# EAGLE design AM-Crystal-RX-LM324 (EAGLE 7.6.0)
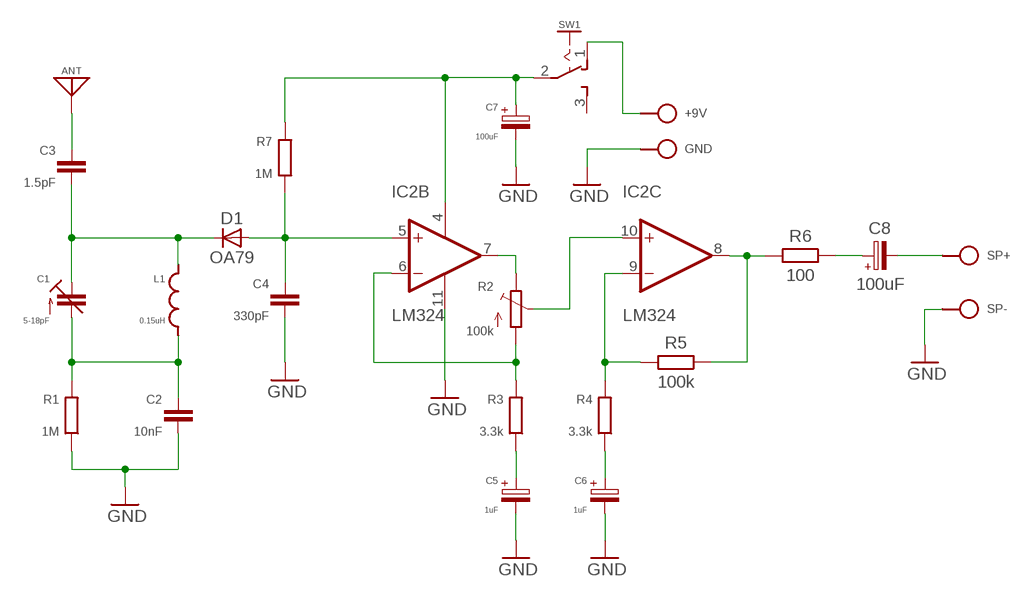
[diagram p0: schematic, sheet 1]

## Parts
+9V  BAT+  SPAD  [SPAD]
ANT  ANT  [SPAD]
C1  5-18pF  C-TR-PH201272222-808-2PIN  [TRIM-2222-808]
C2  10nF  C050-025X075/V  [C050-025X075/V]
C3  1.5pF  C050-020X036  [C050-020X036]
C4  330pF  C050-024X044/V  [C050-024X044/V]
C5  1uF  CPOLE2,5-4/V  [E2.5-4/V]
C6  1uF  CPOLE2,5-3  [E2,5-3]
C7  100uF  CPOLE5-5/V  [E5-5/V]
C8  100uF  CPOLE2,5-5/V  [E2,5-5/V]
D1  OA79  OA7918/V  [OA79-18/V]
GND  BAT-  SPAD  [SPAD]
IC2  LM324  LM324N  [DIL14]
L1  0.15uH  L-SHORT04-5/5  [L-04-5/5]
R1  1M  R0202/7-V  [0202/7-V]
R2  100k  TRIM  [B64Y]
R3  3.3k  R0202/7  [0202/7]
R4  3.3k  R0202/7-V  [0202/7-V]
R5  100k  R0202/7-V  [0202/7-V]
R6  100  R0202/7-V  [0202/7-V]
R7  1M  R0202/7-V  [0202/7-V]
SP+  SPKR+  SPAD  [SPAD]
SP-  SPKR-  SPAD  [SPAD]
SW1  SL-SW-1P-2T-H  [SLSW-1P2T-H]

## Nets
A: IC2.7(B:OUT) R2.E
E: IC2.6(B:-IN) R2.A R3.2
GND: C2.2 C4.2 C5.- C6.- C7.- GND.1 IC2.11(P:V-) R1.1 SP-.1
N$1: C4.1 D1.A IC2.5(B:+IN) R7.1
N$2: C7.+ IC2.4(P:V+) R7.2 SW1.2(P)
N$3: C1.1(A) C2.1 L1.1 R1.2
N$5: C1.2(E) C3.2 D1.C L1.2
N$6: ANT.1 C3.1
N$9: IC2.8(C:OUT) R5.1 R6.2
N$10: IC2.9(C:-IN) R4.2 R5.2
N$11: C5.+ R3.1
N$12: C6.+ R4.1
N$13: C8.+ R6.1
N$14: C8.- SP+.1
N$15: +9V.1 SW1.1(O)
S: IC2.10(C:+IN) R2.S
Unconnected: IC2.1(A:OUT) IC2.2(A:-IN) IC2.3(A:+IN) IC2.12(D:+IN) IC2.13(D:-IN) IC2.14(D:OUT) SW1.3(S)

## Library data of the parts
+9V GND SP+ SP- = pad:SPAD
ANT = pad:ANT
C1 = cap-trim:C-TR-PH20127
C2-C4 = c:C: CAPACITOR, European symbol
C5-C8 = c:CPOL: POLARIZED CAPACITOR, European symbol
D1 = d:OA79
IC2 = ic:LM324: OP AMP
L1 = r:L-SHORT
R1 R3-R7 = r:R: RESISTOR, European symbol
R2 = r:TRIM: POTENTIOMETER
SW1 = sw:SL-SW-1P-2T

## Board
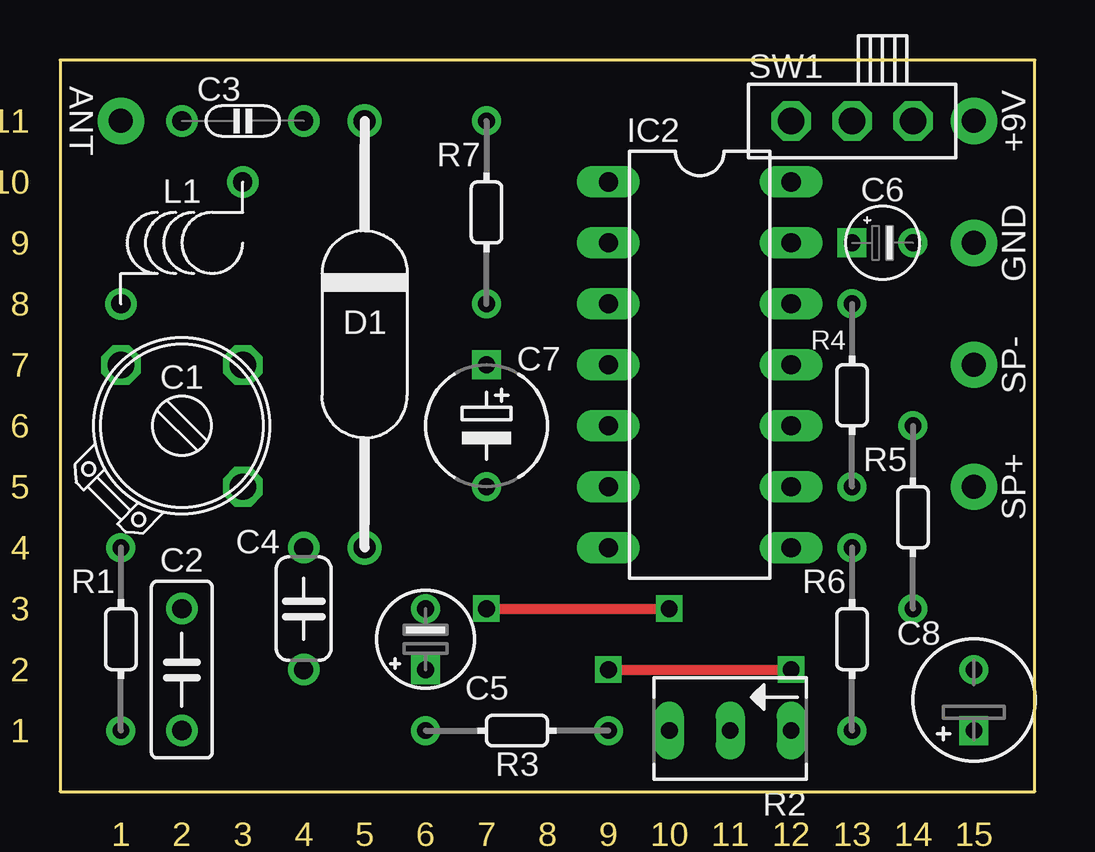
[diagram p1: board, top side]
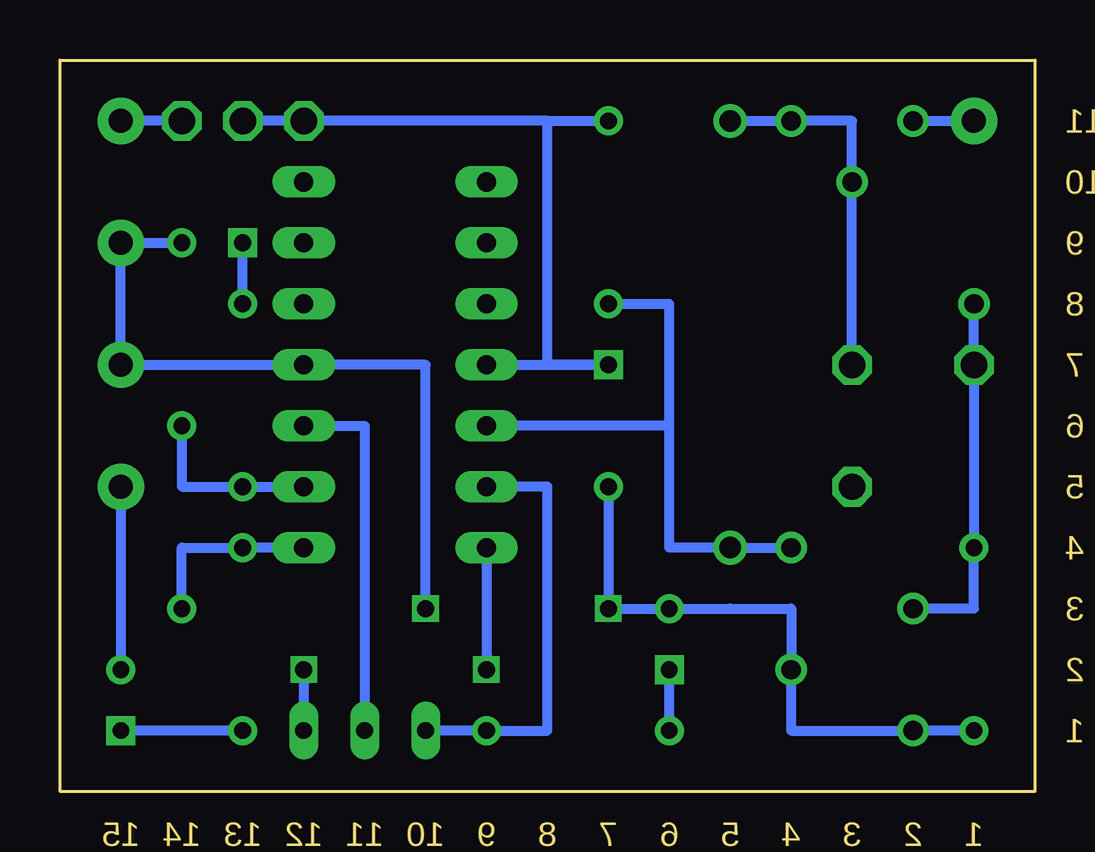
[diagram p2: board, bottom side, seen from below]

Size 40.64 x 30.48 mm. Coordinates in mm from the lower left corner, seen from the top.
Outline: 0,0 40.64,0 40.64,30.48 0,30.48 0,0
Copper layers (1*16): Top 0.035mm / dielectric 1.5mm / Bottom 0.035mm
Design rules "default": minimum track width 10mil, minimum drill 24mil, track to track 8mil, track to pad 8mil, pad to pad 8mil, via to via 8mil, smd to smd 8mil, copper to edge 40mil, drill to drill 8mil, minimum pad ring 10mil, minimum via ring 8mil, stop-mask expansion 4mil, vias tented up to drill 0mil, thermal gap 10mil

### Footprints (pad centres in the part's own frame; a part is rotated, then mirrored left to right if it is on the bottom)
SPAD = drill 1 pad 1.93: 1 0,0
TRIM-2222-808 = drill 1.1 octagon: 1 -2.54,2.54; 2 2.54,2.54; 3 2.54,-2.54
C050-025X075/V = drill 0.8: 1 0,2.54; 2 0,-2.54
C050-020X036 = drill 0.8: 1 0,-2.54; 2 0,2.54
C050-024X044/V = drill 0.8: 1 0,2.54; 2 0,-2.54
E2.5-4/V = drill 0.7 square: + 0,1.27 | drill 0.7: - 0,-1.27
E2,5-3 = drill 0.7 square: + 0,1.27 | drill 0.7: - 0,-1.27
E5-5/V = drill 0.7 square: + 0,2.54 | drill 0.7: - 0,-2.54
E2,5-5/V = drill 0.7 square: + 0,-1.27 | drill 0.7: - 0,1.27
OA79-18/V = drill 0.9: A 0,-8.89; C 0,8.89
DIL14 = drill 0.8 long: 1 -3.81,7.62; 2 -3.81,5.08; 3 -3.81,2.54; 4 -3.81,0; 5 -3.81,-2.54; 6 -3.81,-5.08; 7 -3.81,-7.62; 8 3.81,-7.62; 9 3.81,-5.08; 10 3.81,-2.54; 11 3.81,0; 12 3.81,2.54; 13 3.81,5.08; 14 3.81,7.62
L-04-5/5 = drill 0.8: 1 -2.54,-2.54; 2 2.54,2.54
0202/7-V = drill 0.7: 1 0,-3.81; 2 0,3.81
B64Y = drill 0.7 long: A 2.54,0; E -2.54,0; S 0,0
0202/7 = drill 0.7: 1 0,3.81; 2 0,-3.81
SLSW-1P2T-H = drill 1.1 pad 1.524 octagon: 1 2.54,0; 2 0,0; 3 -2.54,0

### Placement (x,y rotation side)
+9V  38.1,27.94 180 top
ANT  2.54,27.94 0 top
C1  5.08,15.24 0 top
C2  5.08,5.08 0 top
C3  7.62,27.94 270 top
C4  10.16,7.62 0 top
C5  15.24,6.35 180 top
C6  34.29,22.86 90 top
C7  17.78,15.24 0 top
C8  38.1,3.81 0 top
D1  12.7,19.05 0 top
GND  38.1,22.86 180 top
IC2  26.67,17.78 0 top
L1  5.08,22.86 0 top
R1  2.54,6.35 0 top
R2  27.94,2.54 180 top
R3  19.05,2.54 90 top
R4  33.02,16.51 180 top
R5  35.56,11.43 0 top
R6  33.02,6.35 0 top
R7  17.78,24.13 0 top
SP+  38.1,12.7 180 top
SP-  38.1,17.78 180 top
SW1  33.02,27.94 0 top

### Tracks (layer width: path | path; a pad name or v marks a point on that pad's centre or on a via)
A  (via drill 0.7)
  Top 0.406: v22.86,5.08 v30.48,5.08
  Bottom 0.406: IC2.7 v22.86,5.08 | v30.48,5.08 R2.E
E
  Bottom 0.406: IC2.6 20.32,12.7 20.32,2.54 R3.2 R2.A
GND  (via drill 0.7)
  Top 0.406: v17.78,7.62 v25.4,7.62
  Bottom 0.406: C6.- GND.1 SP-.1 IC2.11 25.4,17.78 v25.4,7.62 | C7.- v17.78,7.62 C5.- | R1.1 C2.2 10.16,2.54 C4.2 10.16,7.62 C5.- | C5.- 12.7,7.62
N$1
  Bottom 0.406: 15.24,15.24 IC2.5 | 15.24,15.24 15.24,20.32 R7.1 | 15.24,15.24 15.24,10.16 D1.A C4.1
N$2
  Bottom 0.406: IC2.4 C7.+ 20.32,17.78 20.32,27.94 | 20.32,27.94 SW1.2 | 20.32,27.94 R7.2
N$3
  Bottom 0.406: L1.1 C1.1 R1.2 2.54,7.62 C2.1
N$5
  Bottom 0.406: D1.C C3.2 7.62,27.94 L1.2 C1.2
N$6
  Bottom 0.406: C3.1 ANT.1
N$9
  Bottom 0.406: R5.1 35.56,10.16 R6.2 IC2.8
N$10
  Bottom 0.406: R5.2 35.56,12.7 R4.2 IC2.9
N$11
  Bottom 0.406: R3.1 C5.+
N$12
  Bottom 0.406: R4.1 C6.+
N$13
  Bottom 0.406: R6.1 C8.+
N$14
  Bottom 0.406: SP+.1 C8.-
N$15
  Bottom 0.406: SW1.1 +9V.1
S
  Bottom 0.406: IC2.10 27.94,15.24 R2.S

### Text on the board
Dimension: 11 | 10 | 9 | 8 | 7 | 6 | 5 | 4 | 3 | 2 | 1 | 1 | 2 | 3 | 4 | 5 | 6 | 7 | 8 | 9 | 10 | 11 | 12 | 13 | 14 | 15